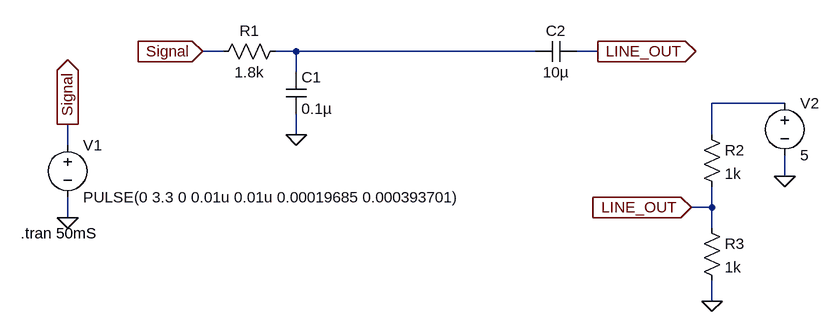
[diagram p0: schematic line-out_simulation_3.asc]
line-out_simulation_3.asc, the LTspice schematic file:
Version 4
SHEET 1 1464 680
WIRE 256 -32 224 -32
WIRE 368 -32 336 -32
WIRE 736 -32 368 -32
WIRE 832 -32 800 -32
WIRE 368 0 368 -32
WIRE 1120 48 1008 48
WIRE 368 96 368 64
WIRE 1008 96 1008 48
WIRE 16 112 16 80
WIRE 1120 160 1120 128
WIRE 1008 208 1008 176
WIRE 1008 208 976 208
WIRE 16 224 16 192
WIRE 1008 240 1008 208
WIRE 1008 352 1008 320
FLAG 16 224 0
FLAG 16 80 Signal
IOPIN 16 80 Out
FLAG 368 96 0
FLAG 832 -32 LINE_OUT
IOPIN 832 -32 Out
FLAG 224 -32 Signal
IOPIN 224 -32 In
FLAG 1120 160 0
FLAG 976 208 LINE_OUT
IOPIN 976 208 In
FLAG 1008 352 0
SYMBOL voltage 16 96 R0
WINDOW 123 0 0 Left 0
WINDOW 39 0 0 Left 0
SYMATTR InstName V1
SYMATTR Value PULSE(0 3.3 0 0.01u 0.01u 0.00019685 0.000393701)
SYMBOL res 352 -48 R90
WINDOW 0 0 56 VBottom 2
WINDOW 3 32 56 VTop 2
SYMATTR InstName R1
SYMATTR Value 1.8k
SYMBOL cap 352 0 R0
SYMATTR InstName C1
SYMATTR Value 0.1µ
SYMBOL cap 800 -48 R90
WINDOW 0 0 32 VBottom 2
WINDOW 3 32 32 VTop 2
SYMATTR InstName C2
SYMATTR Value 10µ
SYMBOL res 992 80 R0
SYMATTR InstName R2
SYMATTR Value 1k
SYMBOL voltage 1120 32 R0
WINDOW 123 0 0 Left 0
WINDOW 39 0 0 Left 0
SYMATTR InstName V2
SYMATTR Value 5
SYMBOL res 992 224 R0
SYMATTR InstName R3
SYMATTR Value 1k
TEXT -56 248 Left 2 !.tran 50mS

The netlist it stands for:
* line-out_simulation_3.asc
V1 Signal 0 PULSE(0 3.3 0 0.01u 0.01u 0.00019685 0.000393701)
R1 N001 Signal 1.8k
C1 N001 0 0.1µ
C2 LINE_OUT N001 10µ
R2 N002 LINE_OUT 1k
V2 N002 0 5
R3 LINE_OUT 0 1k
.tran 50mS
.backanno
.end